# EasyEDA Pro project X转接板V1.0(4040Lite).eprj

# Schematic 原理图
Board Name: esp32; Create Date: 2025-05-14; Page Name: 电源; Project Name: X转接板V1.0(4040Lite); Schematic Name: 原理图; Update Date: 2025-10-10; Company: 嘉立创EDA; Page Size: A3; Version: V1.0
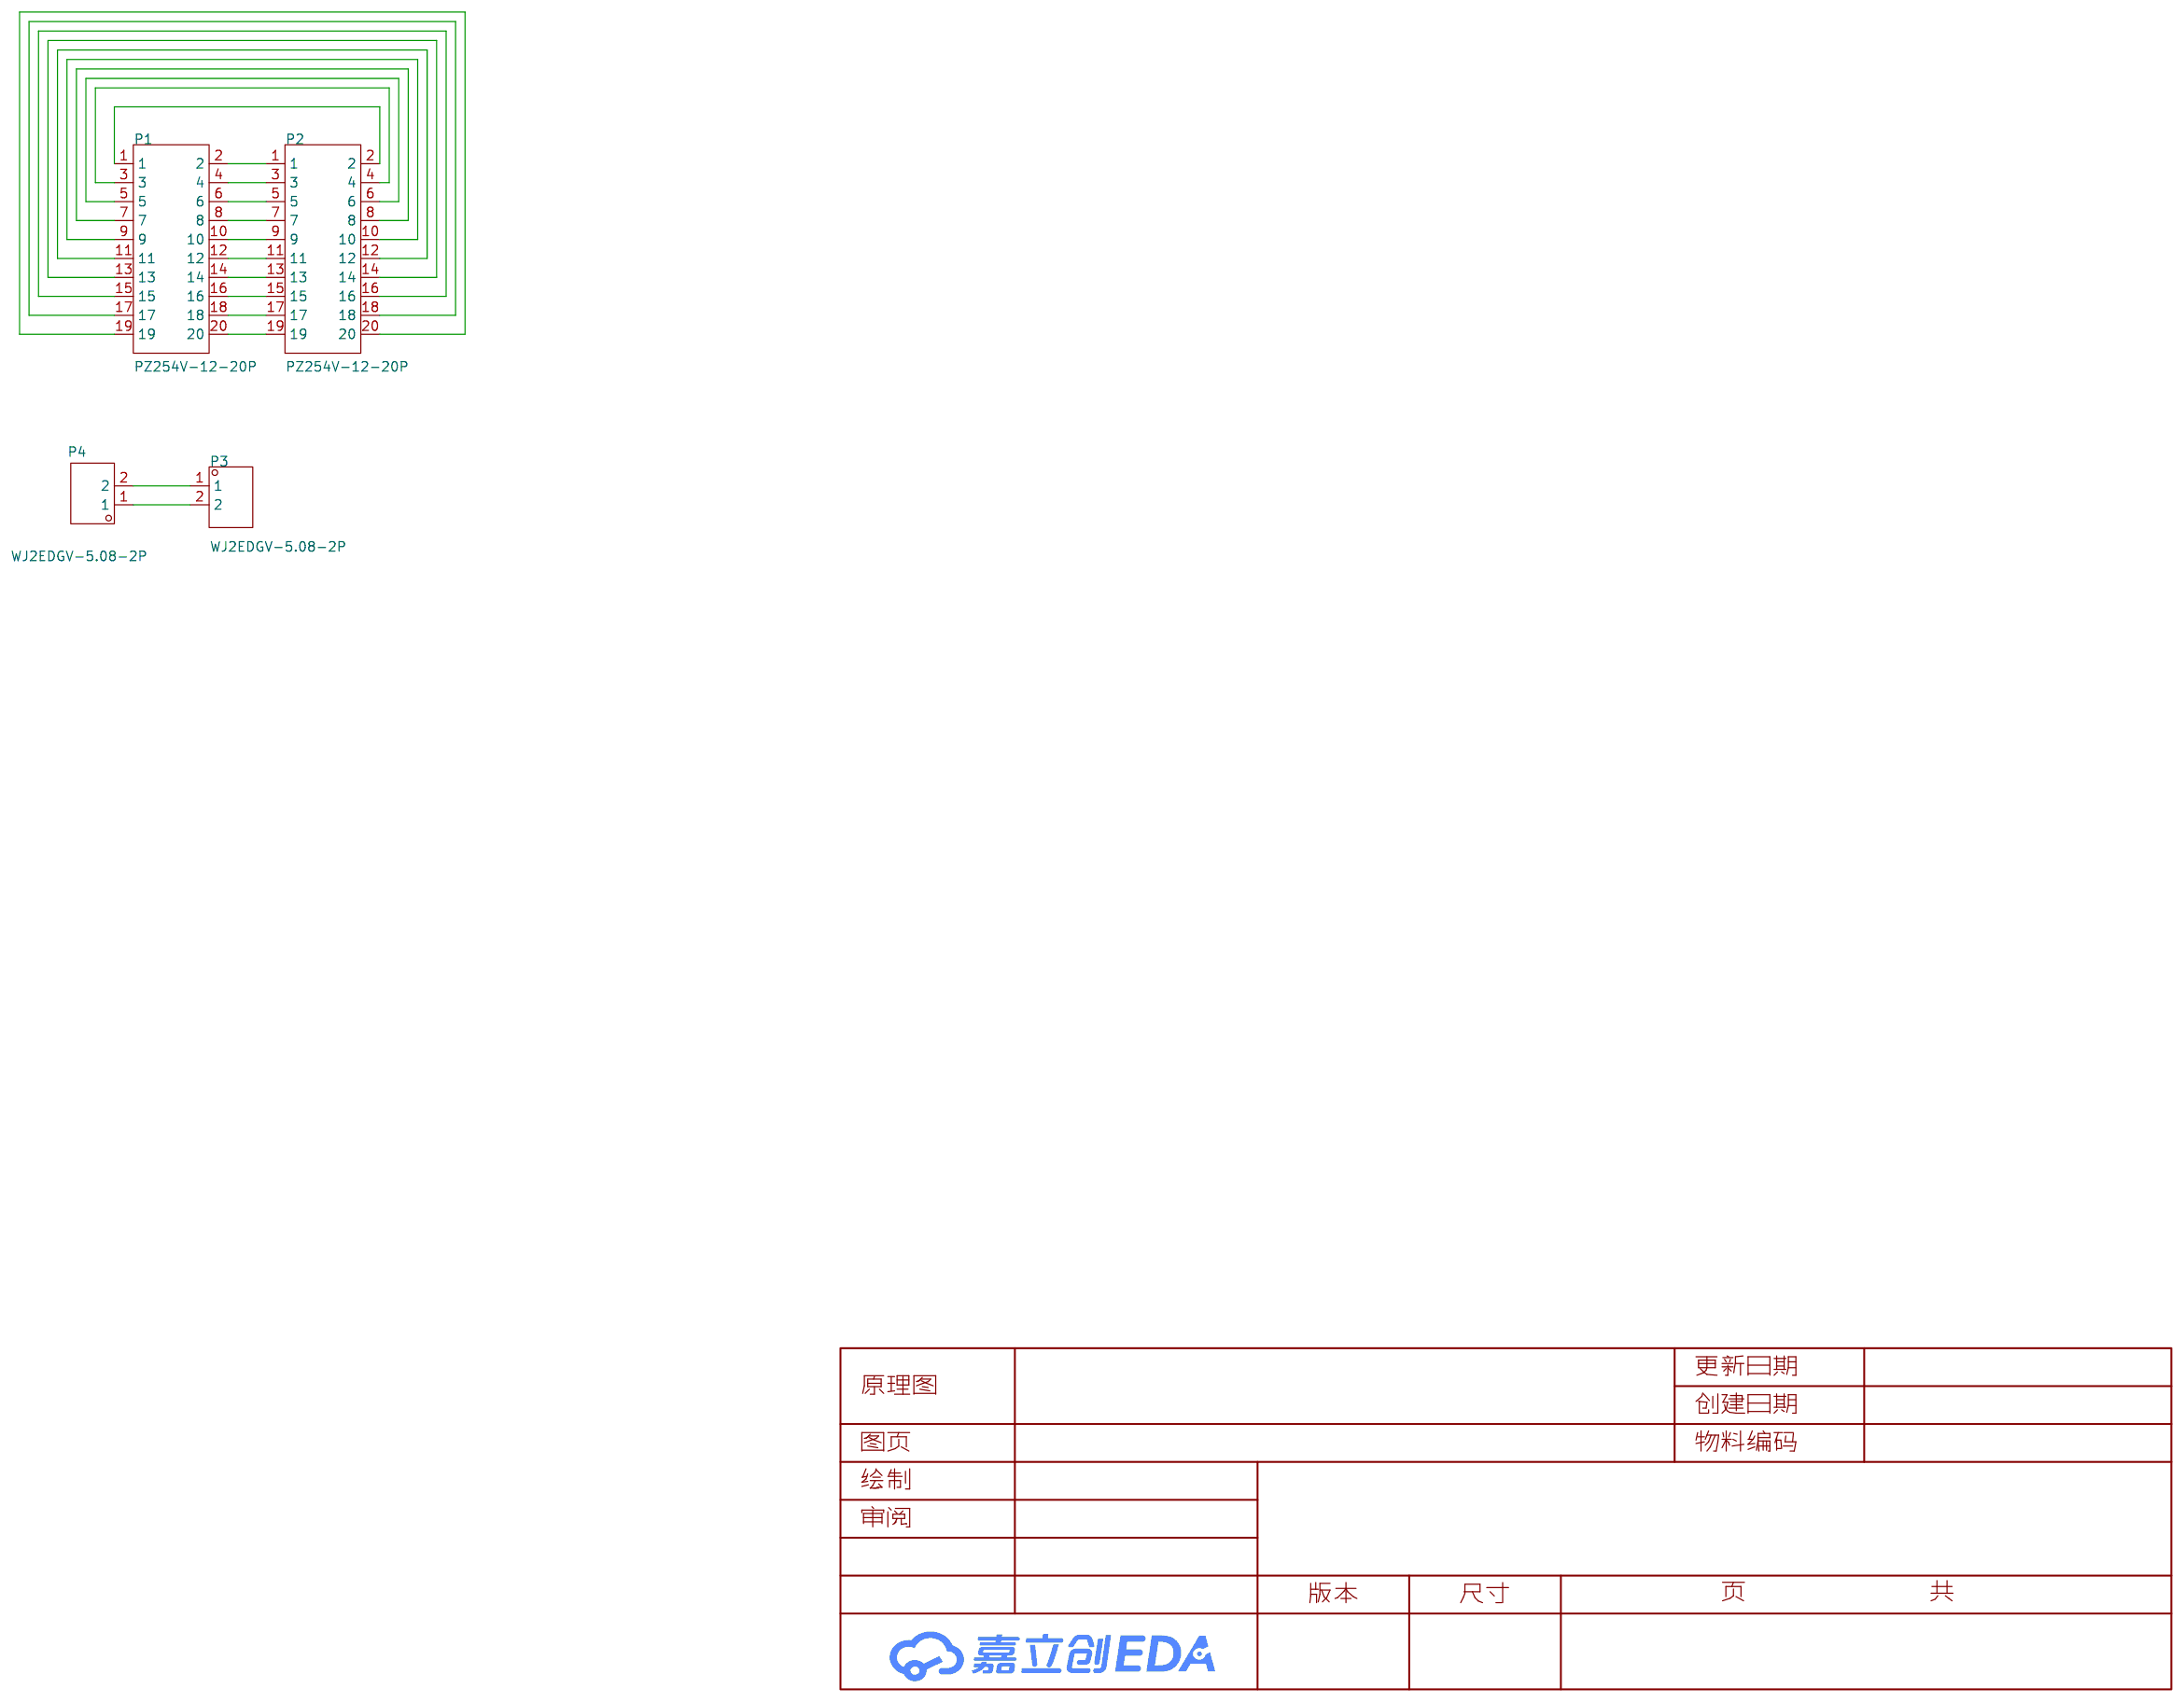
[diagram p0: schematic sheet]

## Parts
P1  PZ254V-12-20P  [HDR-TH_20P-P2.54-V-M-R2-C10-S2.54]
P2  PZ254V-12-20P  [HDR-TH_20P-P2.54-V-M-R2-C10-S2.54]
P3  WJ2EDGV-5.08-2P  [CONN-TH_WJ2EDGV-5.08-2P]
P4  WJ2EDGV-5.08-2P  [CONN-TH_WJ2EDGV-5.08-2P]

## Library data of the parts
P1 P2 = PZ254V-12-20P: LCSC Part Name: 2x10P 间距:2.54mm 方针 直插; Supplier Part: C492427; Manufacturer: XFCN(兴飞); Supplier Footprint: 插件,P=2.54mm; JLCPCB Part Class: 扩展库; Datasheet: https://item.szlcsc.com/datasheet/PZ254V-12-20P/502983.html; Supplier: LCSC; Pin Structure: 2x10P; Pitch: 2.54mm; Row Spacing: 2.54mm; Circluar Pins/Square Pins: 方针; Mounting Type: 直插; Number of Rows: 双排; Number of Pins: 20P; Length of Mating Pin: 6mm; Insulation Height: 2.5mm; Length of End Connection Pin: 3mm; Contact Material: 黄铜; Operating Temperature: -40℃~+105℃; Color: 黑色
P3 P4 = WJ2EDGV-5.08-2P: LCSC Part Name: 1x2P 5.08mm 排数:1 每排P数:2; Supplier Part: C8461; Manufacturer: KANGNEX(康奈克斯电气); Supplier Footprint: 插件,P=5.08mm; JLCPCB Part Class: 扩展库; Datasheet: https://item.szlcsc.com/datasheet/WJ2EDGV-5.08-2P/8955.html; Supplier: LCSC; Connector Type: 板端/插座-开口; Number of Positions or Pins: 1x2P; Pitch: 5.08mm; Color: 绿色; Mounting Type: 直针; Number of Pins: 2P; Number of Rows: 1; Number of PINs Per Row: 2; Operating Temperature: -40℃~+105℃

## Nets
$9N160615: P1.20 P2.19
$9N160617: P1.18 P2.17
$9N160619: P1.16 P2.15
$9N160621: P1.14 P2.13
$9N160623: P1.12 P2.11
$9N160625: P1.10 P2.9
$9N160627: P1.8 P2.7
$9N160629: P1.6 P2.5
$9N160631: P1.4 P2.3
$9N160633: P1.2 P2.1
$9N160819: P3.1 P4.2
$9N160821: P3.2 P4.1
$9N160825: P1.1 P2.2
$9N160831: P1.3 P2.4
$9N160843: P1.5 P2.6
$9N160855: P1.7 P2.8
$9N160871: P1.9 P2.10
$9N160883: P1.11 P2.12
$9N160897: P1.13 P2.14
$9N160911: P1.15 P2.16
$9N160927: P1.17 P2.18
$9N160941: P1.19 P2.20

# Board PCB
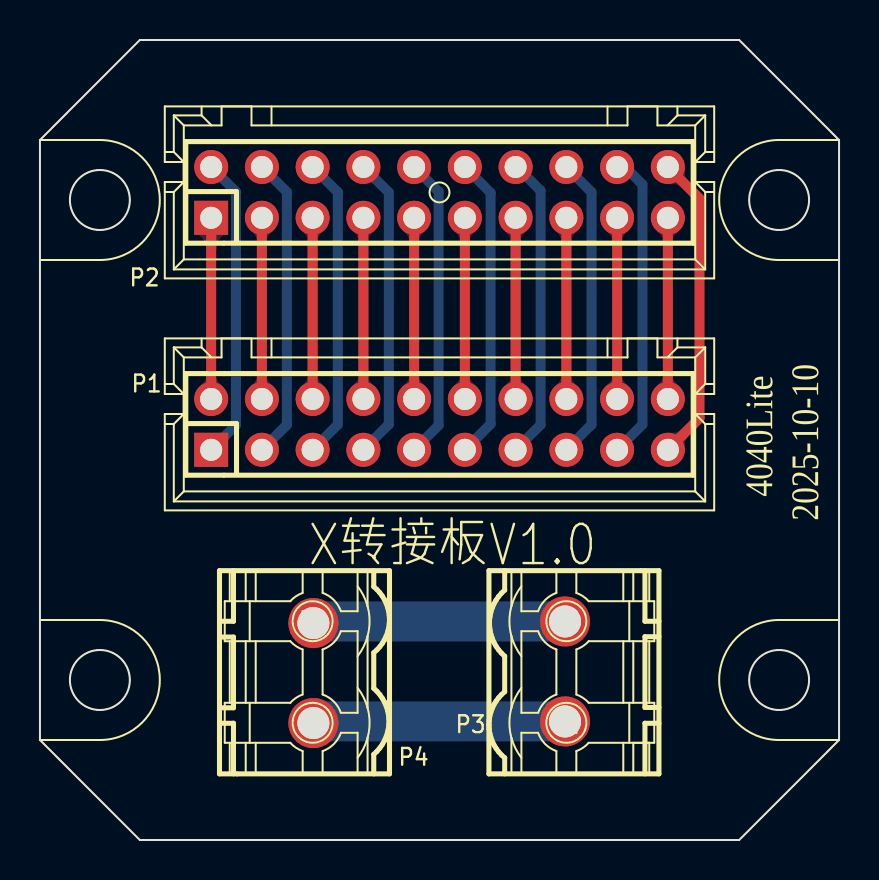
[diagram p1: board, top side]
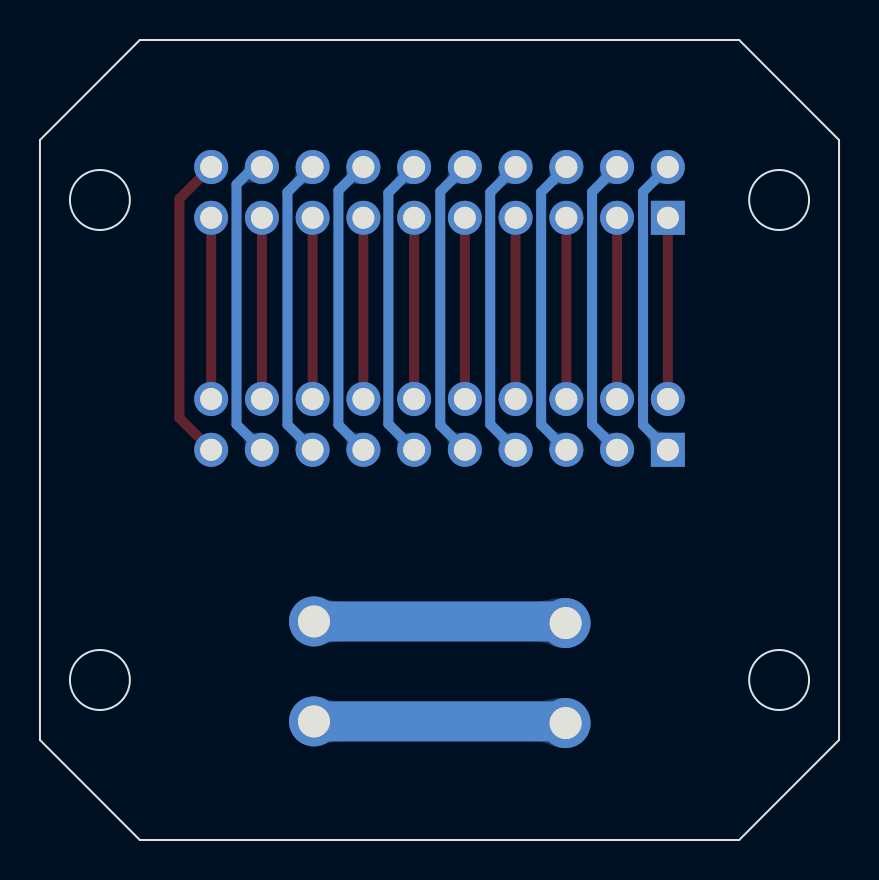
[diagram p2: board, bottom side, seen from below]

Outline 40 x 40 mm; copper layers: Top Layer, Bottom Layer. Coordinates in mm from the lower left corner of the outline.
Outline path: circle c3,32 r1.5 ; circle c3,8 r1.5 ; circle c37,32 r1.5 ; circle c37,8 r1.5 ; 0,5 0,35 5,40 35,40 40,35 40,5 35,0 5,0 0,5
Stack: Top Layer 0.035mm / Dielectric1 1.51mm FR4 er 4.5 / Bottom Layer 0.035mm

## Design rules (mm)
template: 用户自定义配置
spacing Default (default): track to track 0.152, other pairs 0 to 0.152
track width Default (default): min 0.254, default 0.254, max 25.4
differential pair differentialPair (default): width min 0.127, default 0.254, max 2.54; gap min 0.152, default 0.152
via Default (default): diameter min 0.25, default 0.61, max 100.025; hole min 0.2, default 0.305, max 59.995

## Placement (name value [footprint] x y rotation side)
P1  PZ254V-12-20P  [HDR-TH_20P-P2.54-V-M-R2-C10-S2.54]  20 20.78 0 top
P2  PZ254V-12-20P  [HDR-TH_20P-P2.54-V-M-R2-C10-S2.54]  20 32.38 0 top
P3  WJ2EDGV-5.08-2P  [CONN-TH_WJ2EDGV-5.08-2P]  26.28 8.43 270 top
P4  WJ2EDGV-5.08-2P  [CONN-TH_WJ2EDGV-5.08-2P]  13.69 8.35 90 top

## Footprints (pads in the part's own frame, mm; a bottom-side part is the same pattern mirrored in y, then rotated)
CONN-TH_WJ2EDGV-5.08-2P
  round 2.5 hole 1.6: 1(-2.499,0) 2(2.499,0)
HDR-TH_20P-P2.54-V-M-R2-C10-S2.54
  rect 1.7x1.7 hole 1.1: 1(-11.43,-1.27)
  round 1.7 hole 1.1: 2(-11.43,1.27) 3(-8.89,-1.27) 4(-8.89,1.27) 5(-6.35,-1.27) 6(-6.35,1.27) 7(-3.81,-1.27) 8(-3.81,1.27) 9(-1.27,-1.27) 10(-1.27,1.27) 11(1.27,-1.27) 12(1.27,1.27) 13(3.81,-1.27) 14(3.81,1.27) 15(6.35,-1.27) 16(6.35,1.27) 17(8.89,-1.27) 18(8.89,1.27) 19(11.43,-1.27) 20(11.43,1.27)

## Nets
As in the schematic.

## Routing (per net, layer and track width the routed paths; a pad name or vN(x,y) marks a point on that pad's centre or on a via; arc(x,y) is an arc through that point)
$9N160615: length 9.1
  Top Layer w0.5: P2.19 P1.20
$9N160617: length 9.1
  Top Layer w0.5: P1.18 P2.17
$9N160619: length 9.1
  Top Layer w0.5: P2.15 P1.16
$9N160621: length 9.1
  Top Layer w0.5: P2.13 P1.14
$9N160623: length 9.1
  Top Layer w0.5: P2.11 P1.12
$9N160625: length 9.1
  Top Layer w0.5: P2.9 P1.10
$9N160627: length 9.1
  Top Layer w0.5: P2.7 P1.8
$9N160629: length 9.1
  Top Layer w0.5: P2.5 P1.6
$9N160631: length 9.1
  Top Layer w0.5: P2.3 P1.4
$9N160633: length 9.1
  Top Layer w0.5: P2.1 P1.2
$9N160819: length 12.6
  Bottom Layer w2: P3.1 13.77,10.93 P4.2
$9N160821: length 12.6
  Bottom Layer w2: P3.2 13.77,5.93 P4.1
$9N160825: length 15.2
  Bottom Layer w0.5: P1.1 9.81,20.75 9.81,32.41 P2.2
$9N160831: length 15.2
  Bottom Layer w0.5: P2.4 12.36,32.4 12.36,20.76 P1.3
$9N160843: length 15.2
  Bottom Layer w0.5: P1.5 14.91,20.77 14.91,32.39 P2.6
$9N160855: length 15.2
  Bottom Layer w0.5: P1.7 17.46,20.78 17.46,32.38 P2.8
$9N160871: length 15.2
  Bottom Layer w0.5: P2.10 19.96,32.42 19.96,20.74 P1.9
$9N160883: length 15.2
  Bottom Layer w0.5: P2.12 22.56,32.36 22.56,20.8 P1.11
$9N160897: length 15.2
  Bottom Layer w0.5: P1.13 25.06,20.76 25.06,32.47 23.88,33.65 P2.14
$9N160911: length 15.2
  Bottom Layer w0.5: P1.15 27.61,20.77 27.61,32.39 P2.16
$9N160927: length 15.4
  Bottom Layer w0.5: P1.17 30.16,20.78 30.16,32.78 29.29,33.65 P2.18
$9N160941: length 15.5
  Top Layer w0.5: P1.19 33.02,21.1 33.02,32.06 P2.20

Small or netless copper shapes (teardrops, artwork), in the pictures only: 22 on Top Layer, 22 on Bottom Layer

## Text on the board
Top Silkscreen Layer: 4040Lite | 2025-10-10 | X转接板V1.0
